# EAGLE design 100kw dc motor controller (EAGLE 7.4.0)
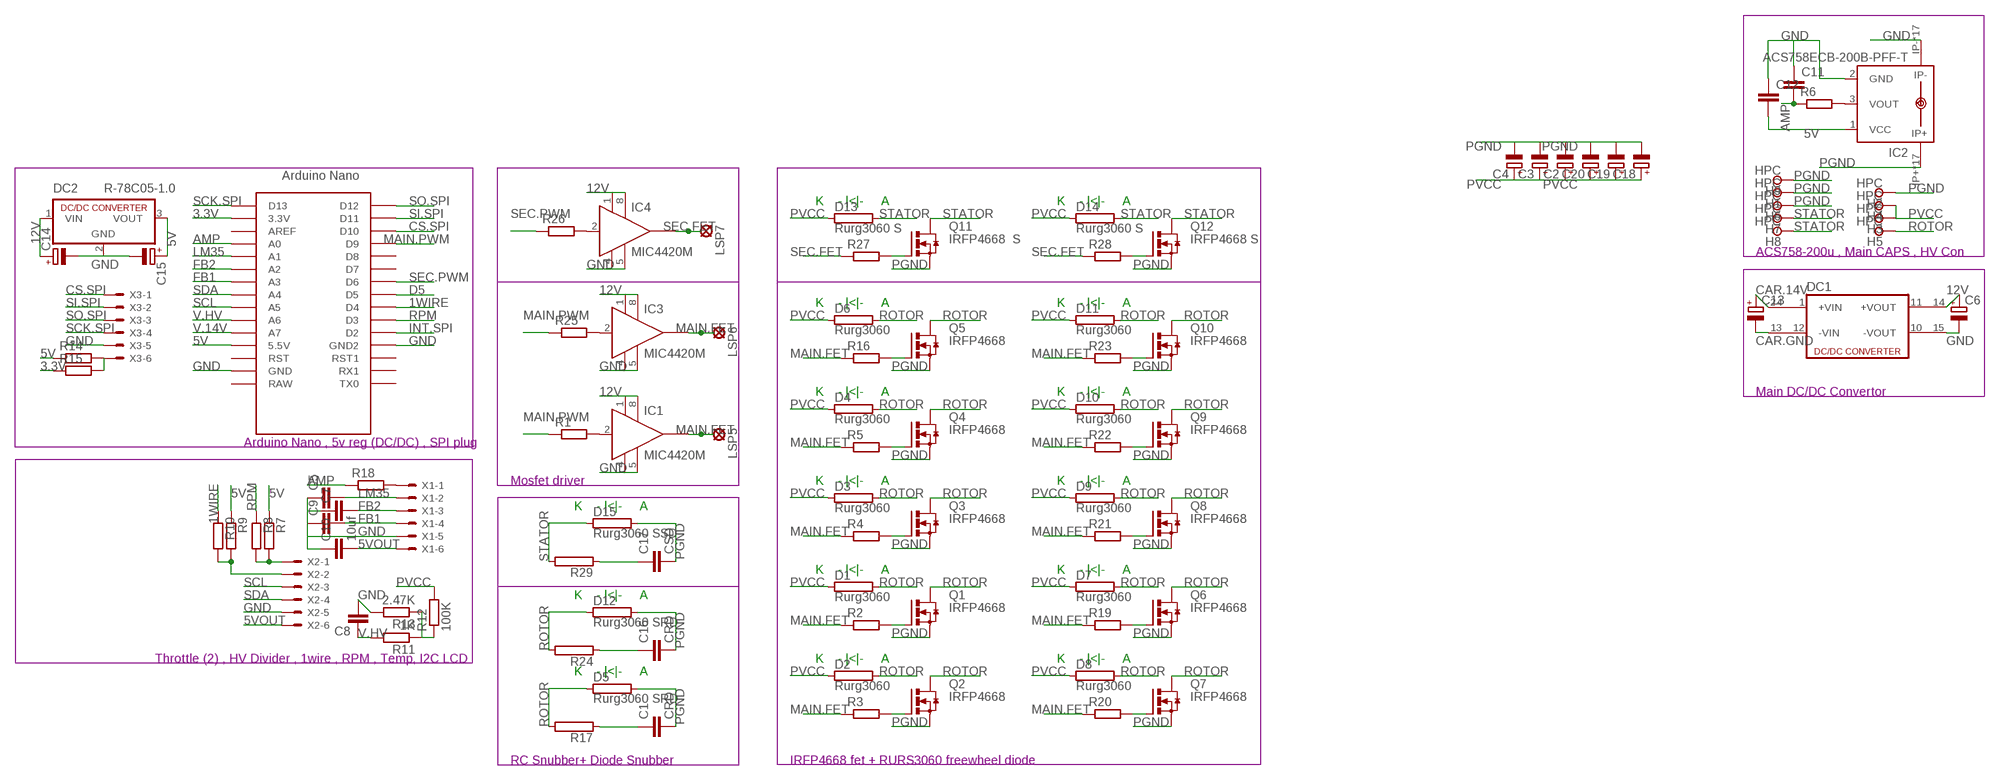
[diagram p0: schematic, sheet 1]

## Parts
C1  CRD  C37/20  [C37.5B20]
C2  CPOL-EUE10-35  [EB35D]
C3  CPOL-EUE10-35  [EB35D]
C4  CPOL-EUE10-35  [EB35D]
C5  C-EUC1206  [C1206]
C6  CPOL-EUE3.5-10  [E3,5-10]
C7  C-EUC1206  [C1206]
C8  C-EUC1206  [C1206]
C9  C-EUC1206  [C1206]
C10  10uf  C-EUC1812  [C1812]
C11  C-EUC1206  [C1206]
C12  C-EUC1206  [C1206]
C13  CPOL-EUE3.5-10  [E3,5-10]
C14  CPOL-EUD/7343-31W  [D/7343-31W]
C15  CPOL-EUD/7343-31W  [D/7343-31W]
C16  CRD  C37/20  [C37.5B20]
C17  CSD  C37/20  [C37.5B20]
C18  CPOL-EUE10-35  [EB35D]
C19  CPOL-EUE10-35  [EB35D]
C20  CPOL-EUE10-35  [EB35D]
D1  Rurg3060  RMG100-H  [TO-247-2H]
D2  Rurg3060  RMG100-H  [TO-247-2H]
D3  Rurg3060  RMG100-H  [TO-247-2H]
D4  Rurg3060  RMG100-H  [TO-247-2H]
D5  Rurg3060 SRD  RMG100-V  [TO-247-2V]
D6  Rurg3060  RMG100-H  [TO-247-2H]
D7  Rurg3060  RMG100-H  [TO-247-2H]
D8  Rurg3060  RMG100-H  [TO-247-2H]
D9  Rurg3060  RMG100-H  [TO-247-2H]
D10  Rurg3060  RMG100-H  [TO-247-2H]
D11  Rurg3060  RMG100-H  [TO-247-2H]
D12  Rurg3060 SRD  RMG100-V  [TO-247-2V]
D13  Rurg3060 S  RMG100-H  [TO-247-2H]
D14  Rurg3060 S  RMG100-H  [TO-247-2H]
D15  Rurg3060 SSD  RMG100-V  [TO-247-2V]
DC1  DCW1U  [DCW]
DC2  R-78C05-1.0  R-78C3.3-1.0  [SIP3]
H1  HPC  SPECIAL_DRILL_0.2500  [PAD_0.2500]
H2  HPC  SPECIAL_DRILL_0.2500  [PAD_0.2500]
H3  HPC  SPECIAL_DRILL_0.2500  [PAD_0.2500]
H4  HPC  SPECIAL_DRILL_0.2500  [PAD_0.2500]
H5  HPC  SPECIAL_DRILL_0.2500  [PAD_0.2500]
H6  HPC  SPECIAL_DRILL_0.2500  [PAD_0.2500]
H7  HPC  SPECIAL_DRILL_0.2500  [PAD_0.2500]
H8  HPC  SPECIAL_DRILL_0.2500  [PAD_0.2500]
H9  HPC  SPECIAL_DRILL_0.2500  [PAD_0.2500]
IC1  MIC4420M  [SO-08]
IC2  ACS758ECB-200B-PFF-T  [CB-PFF]
IC3  MIC4420M  [SO-08]
IC4  MIC4420M  [SO-08]
LSP5  LSP11  [LSP11]
LSP6  LSP11  [LSP11]
LSP7  LSP11  [LSP11]
Q1  IRFP4668  IRFP240-H  [TO247BH]
Q2  IRFP4668  IRFP240-H  [TO247BH]
Q3  IRFP4668  IRFP240-H  [TO247BH]
Q4  IRFP4668  IRFP240-H  [TO247BH]
Q5  IRFP4668  IRFP240-H  [TO247BH]
Q6  IRFP4668  IRFP240-H  [TO247BH]
Q7  IRFP4668  IRFP240-H  [TO247BH]
Q8  IRFP4668  IRFP240-H  [TO247BH]
Q9  IRFP4668  IRFP240-H  [TO247BH]
Q10  IRFP4668  IRFP240-H  [TO247BH]
Q11  IRFP4668 S  IRFP240-H  [TO247BH]
Q12  IRFP4668 S  IRFP240-H  [TO247BH]
R1  R-EU_R1206  [R1206]
R2  R-EU_M5923  [M5923]
R3  R-EU_M5923  [M5923]
R4  R-EU_M5923  [M5923]
R5  R-EU_M5923  [M5923]
R6  R-EU_R1206  [R1206]
R7  R-EU_R1206  [R1206]
R8  R-EU_R1206  [R1206]
R9  R-EU_R1206  [R1206]
R10  R-EU_R1206  [R1206]
R11  1K  R-EU_R1206  [R1206]
R12  100K  R-EU_R1206  [R1206]
R13  2.47K  R-EU_R1206  [R1206]
R14  R-EU_R1206  [R1206]
R15  R-EU_R1206  [R1206]
R16  R-EU_M5923  [M5923]
R17  RKH208-8R  [KH208R-8]
R18  R-EU_R1206  [R1206]
R19  R-EU_M5923  [M5923]
R20  R-EU_M5923  [M5923]
R21  R-EU_M5923  [M5923]
R22  R-EU_M5923  [M5923]
R23  R-EU_M5923  [M5923]
R24  RKH208-8R  [KH208R-8]
R25  R-EU_R1206  [R1206]
R26  R-EU_R1206  [R1206]
R27  R-EU_M5923  [M5923]
R28  R-EU_M5923  [M5923]
R29  RKH208-8R  [KH208R-8]
U$1  NANO  [NANO]
X1  22-23-2061  [22-23-2061]
X2  22-23-2061  [22-23-2061]
X3  22-23-2061  [22-23-2061]

## Nets
1WIRE: R10.1 U$1.D4
3.3V: R15.1 U$1.3.3V
5V: C12.2 C15.+ DC2.3(VOUT) IC2.1(VCC) R7.1 R9.1 R14.1 U$1.5V(5.5V)
5VOUT: C10.2 X1.6 X2.6
12V: C6.+ C14.+ DC1.14(+VOUT1) DC2.1(VIN) IC1.1(VS) IC1.8(VS1) IC3.1(VS) IC3.8(VS1) IC4.1(VS) IC4.8(VS1)
AMP: C11.2 R6.1 R18.1 U$1.A0
CAR.14V: C13.+ DC1.24(+VIN1)
CAR.GND: C13.- DC1.13(-VIN1)
CS.SPI: U$1.D10 X3.1
D5: U$1.D5
FB1: C9.2 U$1.A3 X1.4
FB2: C7.2 U$1.A2 X1.3
GND: C5.1 C6.- C7.1 C8.2 C9.1 C10.1 C11.1 C12.1 C14.- C15.- DC1.15(-VOUT1) DC2.2(GND) IC1.4(GND) IC1.5(GND1) IC2.2(GND) IC2.IP- IC2.IP-@2(IP-) IC2.IP-@3(IP-) IC2.IP-@4(IP-) IC2.IP-@5(IP-) IC2.IP-@6(IP-) IC2.IP-@7(IP-) IC2.IP-@8(IP-) IC2.IP-@9(IP-) IC2.IP-@10(IP-) IC2.IP-@11(IP-) IC2.IP-@12(IP-) IC2.IP-@13(IP-) IC2.IP-@14(IP-) IC2.IP-@15(IP-) IC2.IP-@16(IP-) IC2.IP-@17(IP-) IC3.4(GND) IC3.5(GND1) IC4.4(GND) IC4.5(GND1) R13.2 U$1.GND U$1.GND1(GND2) X1.5 X2.5 X3.5
INT.SPI: U$1.D2
LM35: C5.2 U$1.A1 X1.2
MAIN.FET: IC1.6(OUT) IC3.6(OUT) LSP5.MP LSP6.MP R2.1 R3.1 R4.1 R5.1 R16.1 R19.1 R20.1 R21.1 R22.1 R23.1
MAIN.PWM: R1.1 R25.1 U$1.D9
N$1: IC1.2(IN) R1.2
N$2: Q1.G R2.2
N$3: Q2.G R3.2
N$4: Q3.G R4.2
N$5: Q4.G R5.2
N$6: IC2.3(VOUT) R6.2
N$7: R9.2 R10.2 X2.2
N$8: R7.2 R8.2 X2.1
N$9: R14.2 R15.2 X3.6
N$10: Q5.G R16.2
N$11: C1.1 R17.1
N$12: R18.2 X1.1
N$13: R11.1 R12.1 R13.1
N$14: Q6.G R19.2
N$15: Q7.G R20.2
N$16: Q8.G R21.2
N$17: Q9.G R22.2
N$18: Q10.G R23.2
N$19: C16.1 R24.1
N$20: IC3.2(IN) R25.2
N$21: IC4.2(IN) R26.2
N$22: Q11.G R27.2
N$23: Q12.G R28.2
N$24: C17.1 R29.1
PGND: C1.2 C2.- C3.- C4.- C16.2 C17.2 C18.- C19.- C20.- D5.2 D12.2 D15.2 H1.1 H2.1 H6.1 H9.1 IC2.IP+ IC2.IP+@2(IP+) IC2.IP+@3(IP+) IC2.IP+@4(IP+) IC2.IP+@5(IP+) IC2.IP+@6(IP+) IC2.IP+@7(IP+) IC2.IP+@8(IP+) IC2.IP+@9(IP+) IC2.IP+@10(IP+) IC2.IP+@11(IP+) IC2.IP+@12(IP+) IC2.IP+@13(IP+) IC2.IP+@14(IP+) IC2.IP+@15(IP+) IC2.IP+@16(IP+) IC2.IP+@17(IP+) Q1.S Q2.S Q3.S Q4.S Q5.S Q6.S Q7.S Q8.S Q9.S Q10.S Q11.S Q12.S
PVCC: C2.+ C3.+ C4.+ C18.+ C19.+ C20.+ D1.1 D2.1 D3.1 D4.1 D6.1 D7.1 D8.1 D9.1 D10.1 D11.1 D13.1 D14.1 H3.1 H4.1 R12.2
ROTOR: D1.2 D2.2 D3.2 D4.2 D5.1 D6.2 D7.2 D8.2 D9.2 D10.2 D11.2 D12.1 H5.1 Q1.D Q2.D Q3.D Q4.D Q5.D Q6.D Q7.D Q8.D Q9.D Q10.D R17.2 R24.2
RPM: R8.1 U$1.D3
SCK.SPI: U$1.D13 X3.4
SCL: U$1.A5 X2.3
SDA: U$1.A4 X2.4
SEC.FET: IC4.6(OUT) LSP7.MP R27.1 R28.1
SEC.PWM: R26.1 U$1.D6
SI.SPI: U$1.D11 X3.2
SO.SPI: U$1.D12 X3.3
STATOR: D13.2 D14.2 D15.1 H7.1 H8.1 Q11.D Q12.D R29.2
V.14V: U$1.A7
V.HV: C8.1 R11.2 U$1.A6
Unconnected: DC1.1(+VIN) DC1.10(-VOUT) DC1.11(+VOUT) DC1.12(-VIN) IC1.7(OUT) IC3.7(OUT) IC4.7(OUT) U$1.AREF U$1.D7 U$1.D8 U$1.ICSP1 U$1.ICSP2 U$1.ICSP3 U$1.ICSP4 U$1.ICSP5 U$1.ICSP6 U$1.RAW U$1.RST U$1.RST1 U$1.RX1 U$1.TX0

## Notes on the sheet
- K    - |<|-     A | K    - |<|-     A
- ACS758-200u , Main CAPS , HV Con
- K    - |<|-     A | K    - |<|-     A
- K    - |<|-     A | K    - |<|-     A | Main DC/DC Convertor
- Arduino Nano , 5v reg (DC/DC) , SPI plug
- Mosfet driver | K    - |<|-     A | K    - |<|-     A
- K    - |<|-     A
- K    - |<|-     A | K    - |<|-     A
- K    - |<|-     A
- Throttle (2) , HV Divider , 1wire , RPM , Temp, I2C LCD | K    - |<|-     A | K    - |<|-     A
- K    - |<|-     A
- RC Snubber+ Diode Snubber | IRFP4668 fet + RURS3060 freewheel diode

## Library data of the parts
C1 C16 C17 = capacitor-wima:C: CAPACITOR naming: grid - package width
C2-C4 C6 C13-C15 C18-C20 = rcl:CPOL-EU: POLARIZED CAPACITOR, European symbol
C5 C7-C12 = rcl:C-EU: CAPACITOR, European symbol
D1-D15 = resistor-power:RMG100: TO-247 Power Resistor - RMG 100 Series Source: www.token.com.tw .. power-resistor-rmg100pdf; OC_FARNELL: unknown; OC_NEWARK: unknown
DC1 = dc-dc-converter:DCW1U: DC-DC CONVERTER; OC_FARNELL: unknown; OC_NEWARK: unknown
DC2 = dc-dc-converter:R-78C*-1.0: INNOLINE DC/DC-Converter 1.0 AMP SIP3 Single Output Source: Data sheet <http://www.mikrocontroller.net/attachment/150645/157764-da-01-en-DC_DC_WANDLER_R_78C5_0_1_0.pdf>
H1-H9 = special-drill:SPECIAL_DRILL_: Special drills
IC1 IC3 IC4 = transistor-power:MIC4420: 6A-Peak Low-Side MOSFET Driver Bipolar/CMOS/DMOS Process http://www.micrel.com/_PDF/mic4420.pdf
IC2 = allegro:ACS758*: Thermally Enhanced, Fully Integrated, Hall Effect-Based Linear Current Sensor with 100 micro Ohm Current Conductor display layer 49 Reference in BRD and place VIAs on circles Source: http://www.allegromicro.com/en/Products/Part_Numbers/0758/0758.pdf; MPN: ACS758ECB-200B-PFF-T; OC_FARNELL: 1718993; OC_NEWARK: 04R7127
LSP5-LSP7 = solpad:LSP11: SOLDER PAD drill 1.1 mm
Q1-Q12 = transistor-power:IRFP240: HEXFET Power MosFet Source: http://www.irf.com/
R1-R16 R18-R23 R25-R28 = rcl:R-EU_: RESISTOR, European symbol
R17 R24 R29 = resistor-power:R: Power Resitor; OC_FARNELL: unknown; OC_NEWARK: unknown
U$1 = Arduino-clone (1):NANO: Arduino Nano
X1-X3 = con-molex:22-23-2061: .100" (2.54mm) Center Header - 6 Pin; MF: MOLEX; MPN: 22-23-2061; OC_FARNELL: 1462922; OC_NEWARK: 27C1933

## Board
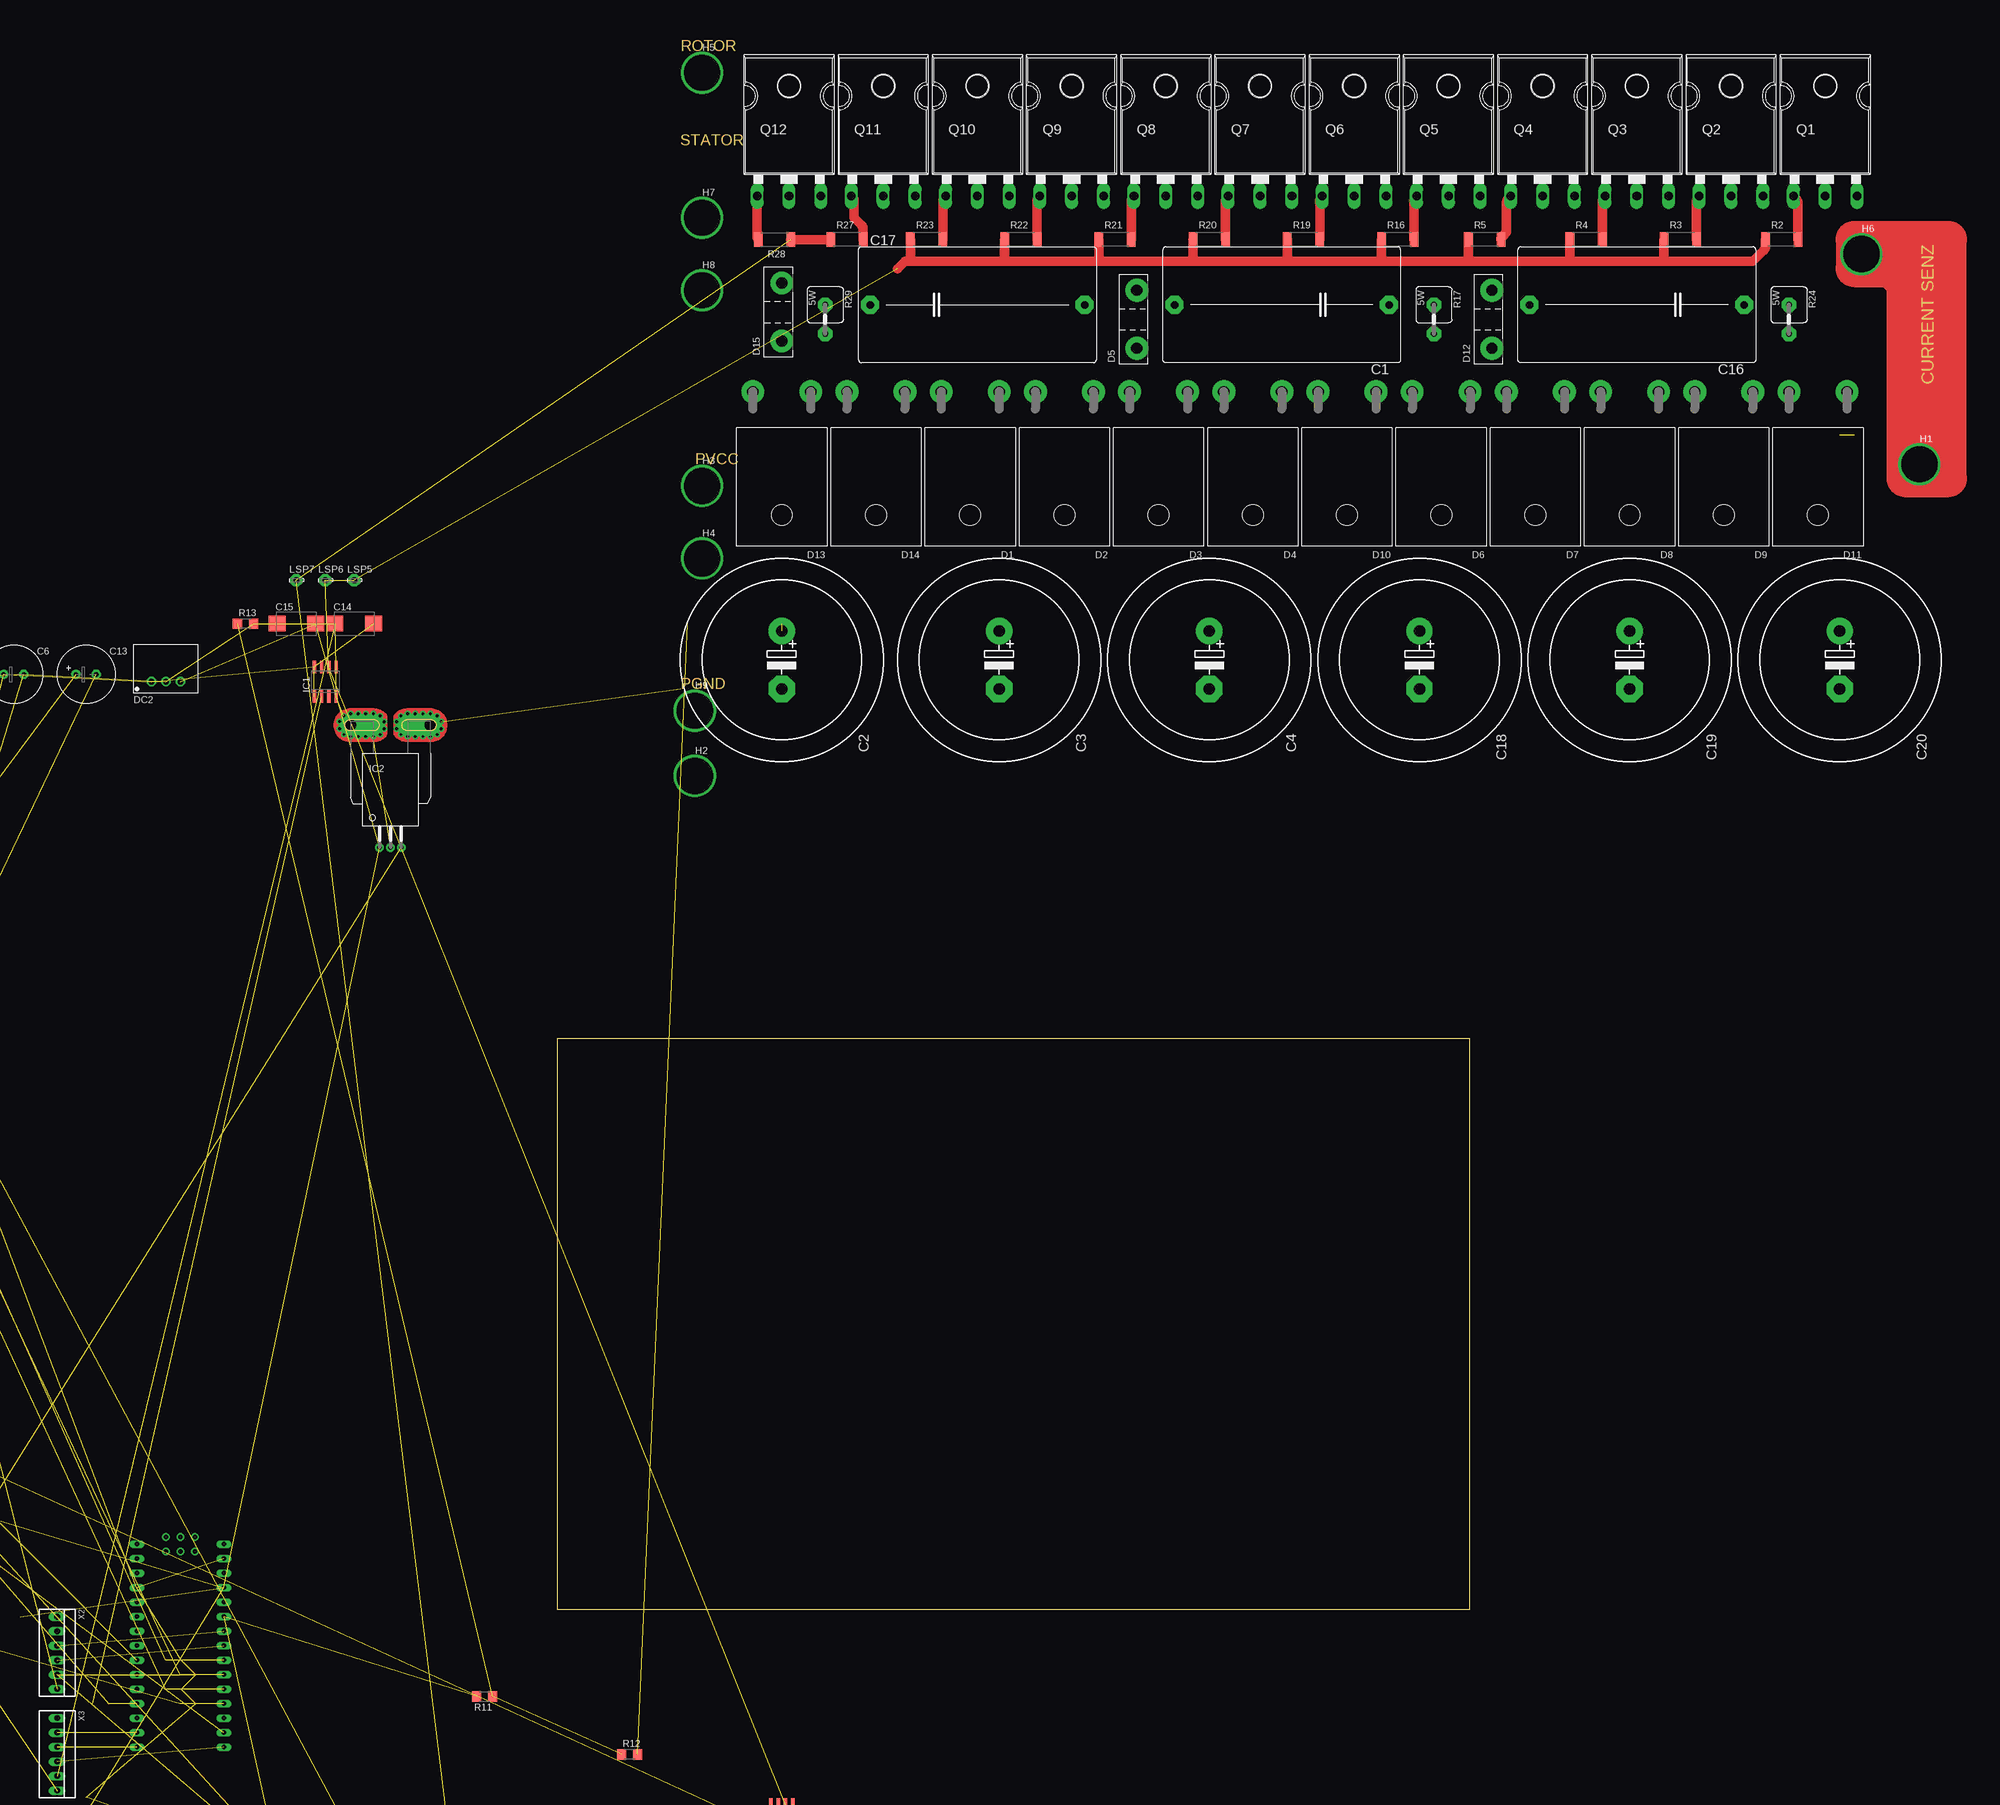
[diagram p1: board, top side]
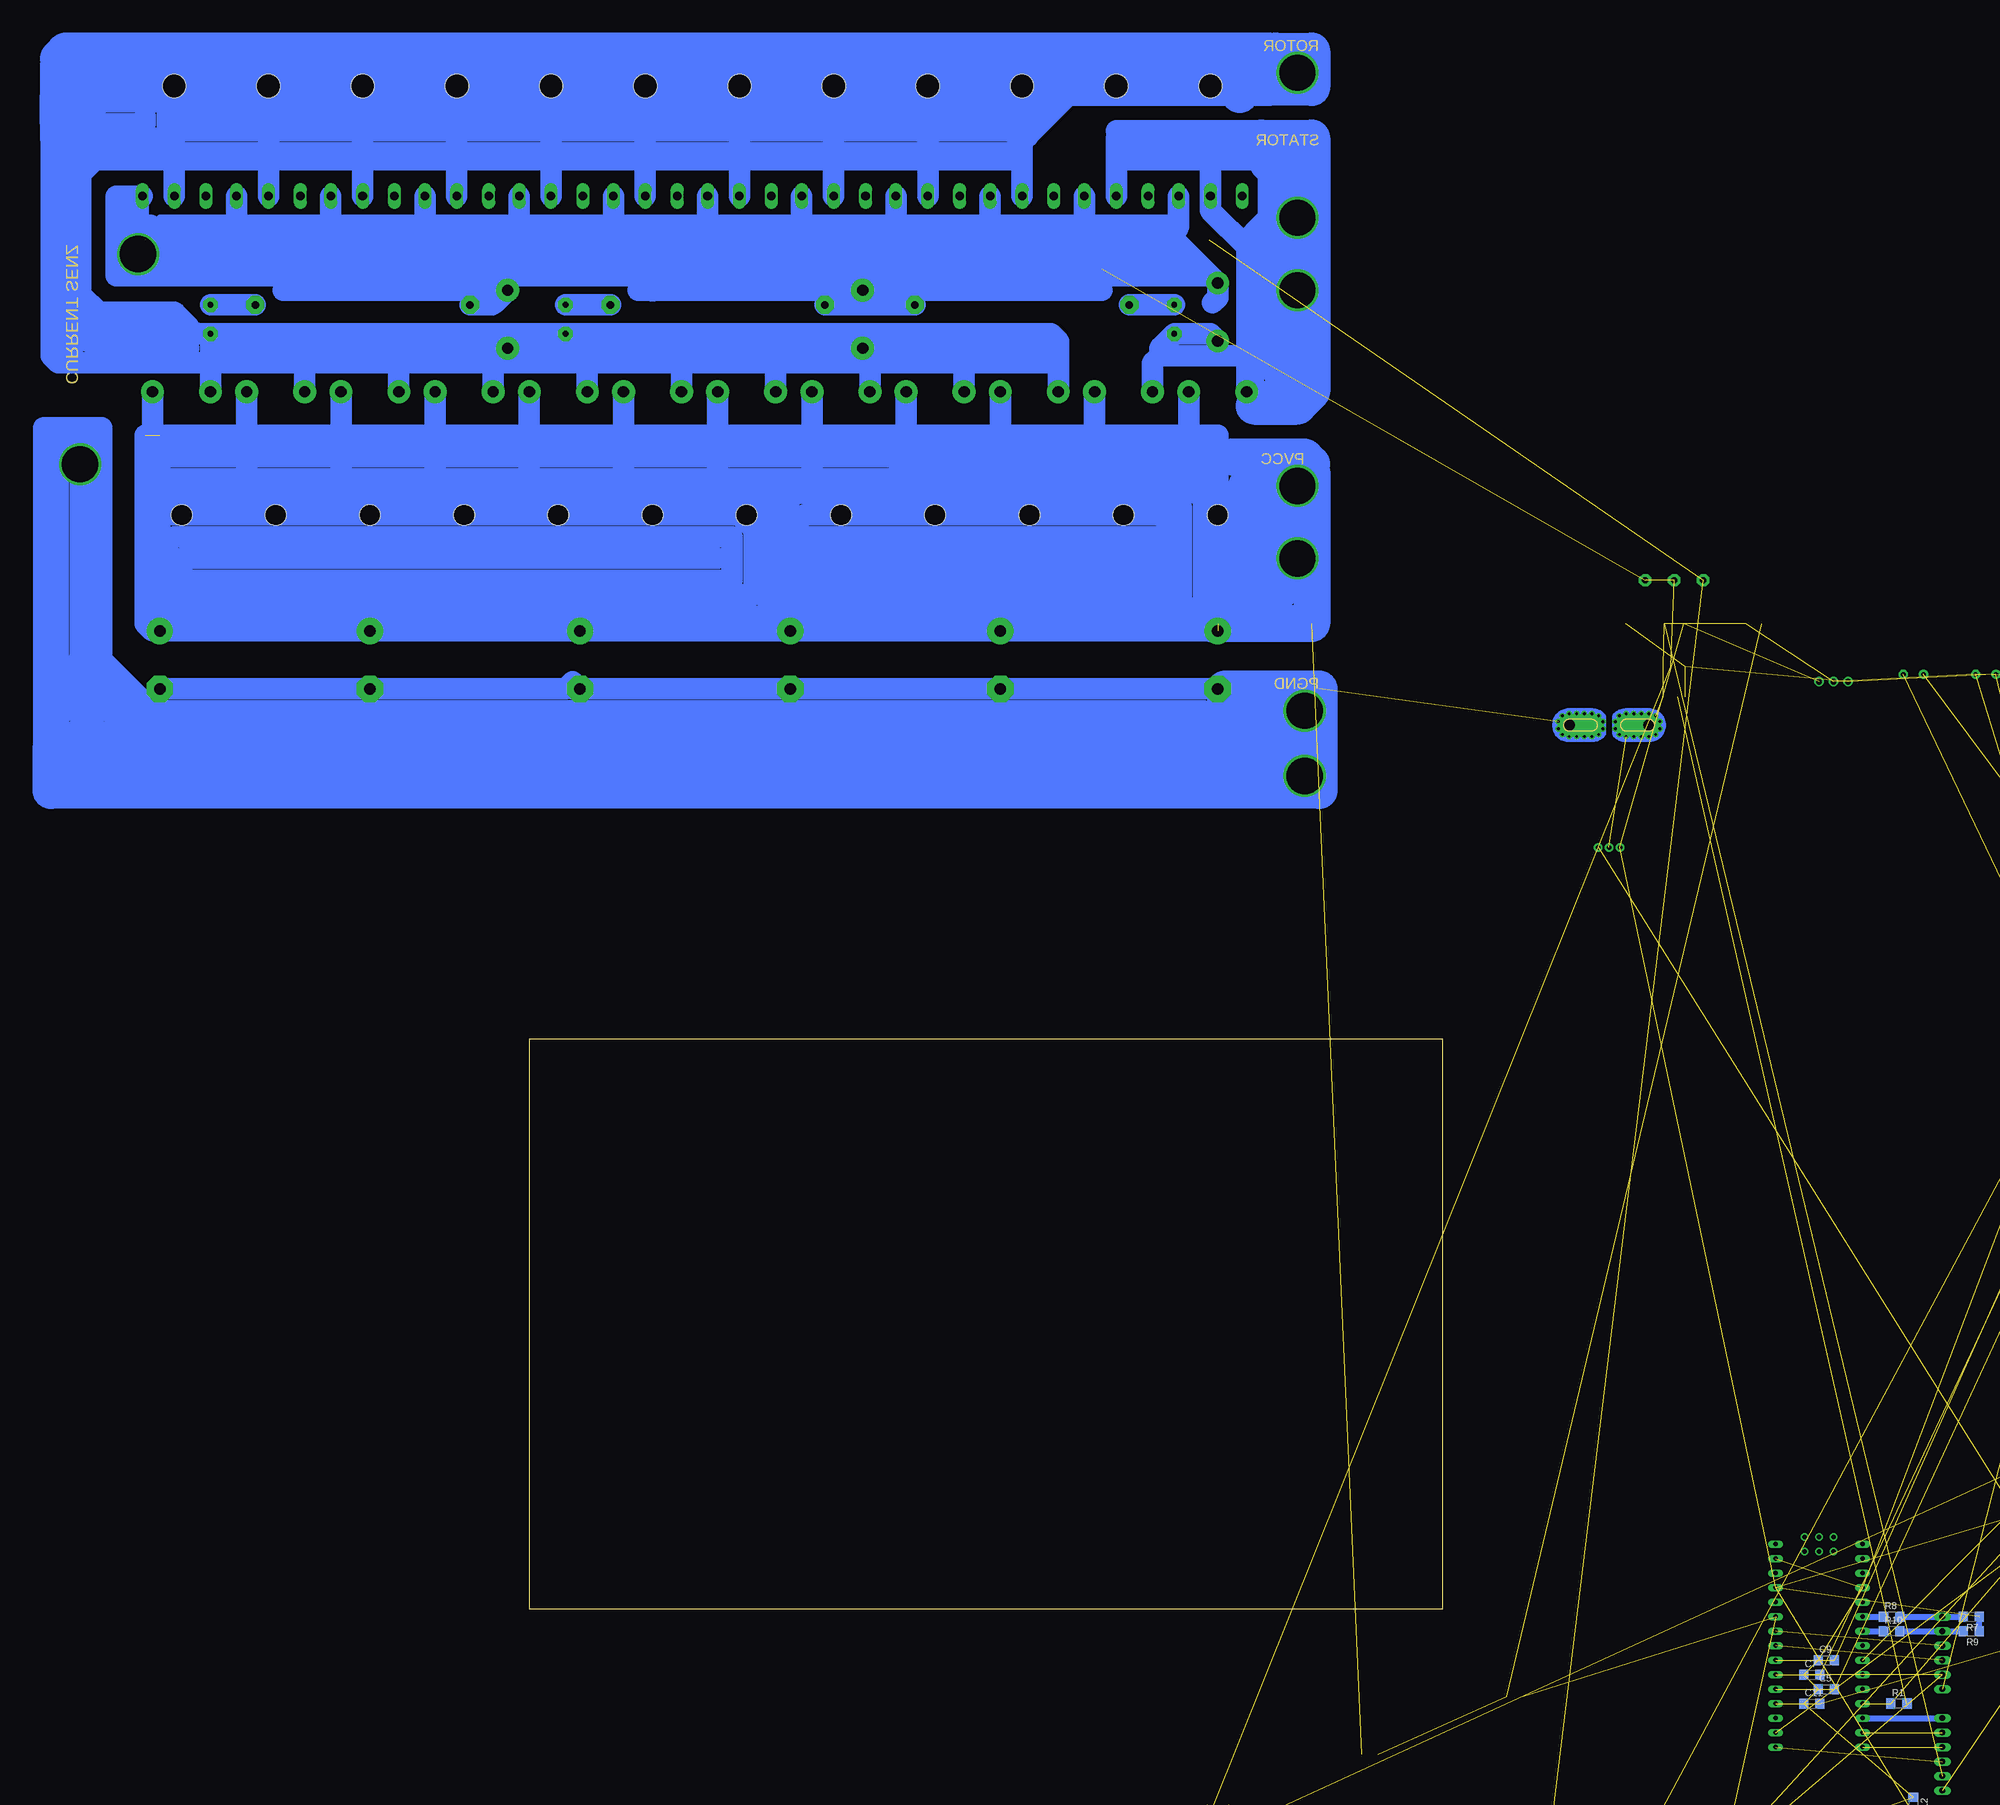
[diagram p2: board, bottom side, seen from below]

Size 160 x 100 mm. Coordinates in mm from the lower left corner, seen from the top.
Outline: 0,0 160,0 160,100 0,100 0,0
Copper layers (1*16): Top 0.035mm / dielectric 1.5mm / Bottom 0.035mm
Design rules "default": minimum track width 10mil, minimum drill 24mil, track to track 8mil, track to pad 8mil, pad to pad 8mil, via to via 8mil, smd to smd 8mil, copper to edge 40mil, drill to drill 8mil, minimum pad ring 10mil, minimum via ring 8mil, stop-mask expansion 4mil, vias tented up to drill 0mil, thermal gap 10mil

### Footprints (pad centres in the part's own frame; a part is rotated, then mirrored left to right if it is on the bottom)
C37.5B20 = drill 1.321 pad 3.15 octagon: 1 -18.796,0; 2 18.796,0
EB35D = drill 2.007 pad 4.597: + -5.08,0 | drill 2.007 pad 4.597 octagon: - 5.08,0
C1206 = smd 1.6 x 1.8: 1 -1.4,0; 2 1.4,0
E3,5-10 = drill 0.813 pad 1.6: + -1.778,0 | drill 0.813 pad 1.6 octagon: - 1.778,0
C1812 = smd 1.9 x 3.4: 1 -1.95,0; 2 1.95,0
D/7343-31W = smd 2.95 x 2.7: + 3.375,0; - -3.375,0
TO-247-2H = drill 2 pad 4: 1 -5.08,-21.59; 2 5.08,-21.59 | hole 3.7: 0,0
TO-247-2V = drill 2 pad 4: 1 -5.08,0; 2 5.08,0
DCW = drill 0.813 long: 1 -7.62,13.97; 2 -7.62,11.43; 3 -7.62,8.89; 10 -7.62,-8.89; 11 -7.62,-11.43; 12 -7.62,-13.97; 13 7.62,-13.97; 14 7.62,-11.43; 15 7.62,-8.89; 22 7.62,8.89; 23 7.62,11.43; 24 7.62,13.97
SIP3 = drill 1 pad 1.676: 1 -2.54,0; 2 0,0; 3 2.54,0
PAD_0.2500 = drill 6.35 pad 6.35: 1 0,0
SO-08 = smd 0.6 x 2.2: 1 -1.905,-2.6; 2 -0.635,-2.6; 3 0.635,-2.6; 4 1.905,-2.6; 5 1.905,2.6; 6 0.635,2.6; 7 -0.635,2.6; 8 -1.905,2.6
CB-PFF = drill 0.8 pad 1.5: 1 -1.91,-21.4; 2 0,-21.4; 3 1.91,-21.4 | drill 2 pad 4 offset: IP+ 7,0; IP- -7,0 | drill 0.5 pad 0.9: IP+@2 8.89,0.635; IP+@3 8.89,-0.635; IP+@4 8.175,-1.625; IP+@5 7,-2; IP+@6 5.675,-2; IP+@7 4.35,-2; IP+@8 3,-2; IP+@9 1.825,-1.625; IP+@10 1.1,-0.625; IP+@11 1.1,0.625; IP+@12 1.825,1.625; IP+@13 3,2; IP+@14 4.35,2; IP+@15 5.675,2; IP+@16 7,2; IP+@17 8.175,1.625; IP-@2 -8.89,0.635; IP-@3 -8.89,-0.635; IP-@4 -8.175,-1.625; IP-@5 -7,-2; IP-@6 -5.675,-2; IP-@7 -4.325,-2; IP-@8 -3,-2; IP-@9 -1.825,-1.625; IP-@10 -1.1,-0.625; IP-@11 -1.1,0.625; IP-@12 -1.825,1.625; IP-@13 -3,2; IP-@14 -4.325,2; IP-@15 -5.675,2; IP-@16 -7,2; IP-@17 -8.175,1.625
LSP11 = drill 1.118 pad 2.159 octagon: MP 0,0
TO247BH = drill 1.499 long: D 0,-10.16; G -5.588,-10.16; S 5.588,-10.16 | hole 4.115: 0,9.144
R1206 = smd 1.6 x 1.803: 1 -1.422,0; 2 1.422,0
M5923 = smd 1.5 x 2.6: 1 -2.85,0; 2 2.85,0
KH208R-8 = drill 1.016 pad 2.54 octagon: 1 -2.54,0; 2 2.54,0
NANO = drill 0.8 long: 3.3V -10.16,24.13; 5V -10.16,-1.27; A0 -10.16,19.05; A1 -10.16,16.51; A2 -10.16,13.97; A3 -10.16,11.43; A4 -10.16,8.89; A5 -10.16,6.35; A6 -10.16,3.81; A7 -10.16,1.27; AREF -10.16,21.59; D2 5.08,1.27; D3 5.08,3.81; D4 5.08,6.35; D5 5.08,8.89; D6 5.08,11.43; D7 5.08,13.97; D8 5.08,16.51; D9 5.08,19.05; D10 5.08,21.59; D11 5.08,24.13; D12 5.08,26.67; D13 -10.16,26.67; GND -10.16,-6.35; GND1 5.08,-1.27; RAW -10.16,-8.89; RST -10.16,-3.81; RST1 5.08,-3.81; RX1 5.08,-6.35; TX0 5.08,-8.89 | drill 0.8: ICSP1 -5.08,-10.16; ICSP2 -5.08,-7.62; ICSP3 -2.54,-10.16; ICSP4 -2.54,-7.62; ICSP5 0,-10.16; ICSP6 0,-7.62
22-23-2061 = drill 1 long: 1 -6.35,0; 2 -3.81,0; 3 -1.27,0; 4 1.27,0; 5 3.81,0; 6 6.35,0

### Placement (x,y rotation side)
C1  127,228.6 180 top  (outside the outline)
C2  39.37,166.37 270 top  (outside the outline)
C3  77.47,166.37 270 top  (outside the outline)
C4  114.3,166.37 270 top  (outside the outline)
C5  -67.31,-13.97 0 bottom  (outside the outline)
C6  -95.25,163.83 0 top  (outside the outline)
C7  -64.77,-11.43 0 bottom  (outside the outline)
C8  -49.53,-43.18 270 top  (outside the outline)
C9  -67.31,-8.89 0 bottom  (outside the outline)
C10  -134.62,162.56 0 top  (outside the outline)
C11  -64.77,-16.51 0 bottom  (outside the outline)
C12  -82.55,-34.29 270 bottom  (outside the outline)
C13  -82.55,163.83 0 top  (outside the outline)
C14  -35.56,172.72 0 top  (outside the outline)
C15  -45.72,172.72 0 top  (outside the outline)
C16  189.23,228.6 180 top  (outside the outline)
C17  73.66,228.6 0 top  (outside the outline)
C18  151.13,166.37 270 top  (outside the outline)
C19  187.96,166.37 270 top  (outside the outline)
C20  224.79,166.37 270 top  (outside the outline)
D1  72.39,191.77 180 top  (outside the outline)
D2  88.9,191.77 180 top  (outside the outline)
D3  105.41,191.77 180 top  (outside the outline)
D4  121.92,191.77 180 top  (outside the outline)
D5  101.6,226.06 90 top  (outside the outline)
D6  154.94,191.77 180 top  (outside the outline)
D7  171.45,191.77 180 top  (outside the outline)
D8  187.96,191.77 180 top  (outside the outline)
D9  204.47,191.77 180 top  (outside the outline)
D10  138.43,191.77 180 top  (outside the outline)
D11  220.98,191.77 180 top  (outside the outline)
D12  163.83,226.06 90 top  (outside the outline)
D13  39.37,191.77 180 top  (outside the outline)
D14  55.88,191.77 180 top  (outside the outline)
D15  39.37,227.33 90 top  (outside the outline)
DC1  -119.38,113.03 0 top  (outside the outline)
DC2  -68.58,162.56 0 top  (outside the outline)
H1  238.76,200.66 0 top  (outside the outline)
H2  24.13,146.05 0 top  (outside the outline)
H3  25.4,196.85 0 top  (outside the outline)
H4  25.4,184.15 0 top  (outside the outline)
H5  25.4,269.24 0 top  (outside the outline)
H6  228.6,237.49 0 top  (outside the outline)
H7  25.4,243.84 0 top  (outside the outline)
H8  25.4,231.14 0 top  (outside the outline)
H9  24.13,157.48 0 top  (outside the outline)
IC1  -40.64,162.56 0 top  (outside the outline)
IC2  -29.21,154.94 0 top  (outside the outline)
IC3  39.37,-36.83 0 top  (outside the outline)
IC4  -15.24,-77.47 0 top  (outside the outline)
LSP5  -35.56,180.34 0 top  (outside the outline)
LSP6  -40.64,180.34 0 top  (outside the outline)
LSP7  -45.72,180.34 0 top  (outside the outline)
Q1  222.25,257.81 0 top  (outside the outline)
Q2  205.74,257.81 0 top  (outside the outline)
Q3  189.23,257.81 0 top  (outside the outline)
Q4  172.72,257.81 0 top  (outside the outline)
Q5  156.21,257.81 0 top  (outside the outline)
Q6  139.7,257.81 0 top  (outside the outline)
Q7  123.19,257.81 0 top  (outside the outline)
Q8  106.68,257.81 0 top  (outside the outline)
Q9  90.17,257.81 0 top  (outside the outline)
Q10  73.66,257.81 0 top  (outside the outline)
Q11  57.15,257.81 0 top  (outside the outline)
Q12  40.64,257.81 0 top  (outside the outline)
R1  -80.01,-16.51 0 bottom  (outside the outline)
R2  214.63,240.03 0 top  (outside the outline)
R3  196.85,240.03 0 top  (outside the outline)
R4  180.34,240.03 0 top  (outside the outline)
R5  162.56,240.03 0 top  (outside the outline)
R6  -114.3,-3.81 270 bottom  (outside the outline)
R7  -92.71,-1.27 180 bottom  (outside the outline)
R8  -78.74,-1.27 0 bottom  (outside the outline)
R9  -92.71,-3.81 180 bottom  (outside the outline)
R10  -78.74,-3.81 0 bottom  (outside the outline)
R11  -12.7,-15.24 180 top  (outside the outline)
R12  12.7,-25.4 0 top  (outside the outline)
R13  -54.61,172.72 0 top  (outside the outline)
R14  -127,22.86 270 top  (outside the outline)
R15  -127,27.94 270 top  (outside the outline)
R16  147.32,240.03 0 top  (outside the outline)
R17  153.67,226.06 270 top  (outside the outline)
R18  -127,33.02 270 top  (outside the outline)
R19  130.81,240.03 0 top  (outside the outline)
R20  114.3,240.03 0 top  (outside the outline)
R21  97.79,240.03 0 top  (outside the outline)
R22  81.28,240.03 0 top  (outside the outline)
R23  64.77,240.03 0 top  (outside the outline)
R24  215.9,226.06 270 top  (outside the outline)
R25  -127,38.1 270 top  (outside the outline)
R26  -127,43.18 270 top  (outside the outline)
R27  50.8,240.03 0 top  (outside the outline)
R28  38.1,240.03 180 top  (outside the outline)
R29  46.99,226.06 270 top  (outside the outline)
U$1  -68.58,2.54 180 top  (outside the outline)
X1  -146.05,161.29 0 top  (outside the outline)
X2  -87.63,-7.62 270 top  (outside the outline)
X3  -87.63,-25.4 270 top  (outside the outline)

### Tracks (layer width: path | path; a pad name or v marks a point on that pad's centre or on a via)
1WIRE
  Bottom 1.016: U$1.D4 R10.1
3.3V  (1 unrouted)
5V  (6 unrouted)
  Bottom 1.016: R9.1 R7.1
5VOUT  (2 unrouted)
12V  (9 unrouted)
AMP  (3 unrouted)
CAR.14V  (1 unrouted)
CAR.GND  (1 unrouted)
CS.SPI
  Bottom 1.016: U$1.D10 X3.1
FB1  (2 unrouted)
FB2  (2 unrouted)
GND  (25 unrouted)
LM35  (2 unrouted)
MAIN.FET  (4 unrouted)
  Top 1.676: R2.1 211.78,238.98 arc-45 211.41,238.08 209.55,236.22 194.31,236.22 | 194.31,236.22 177.8,236.22 | 177.8,236.22 160.02,236.22 | 160.02,236.22 144.78,236.22 | 144.78,236.22 128.27,236.22 | 128.27,236.22 111.76,236.22 | 111.76,236.22 95.25,236.22 | 95.25,236.22 78.74,236.22 | 78.74,236.22 62.23,236.22 | 62.23,236.22 60.96,236.22 59.69,234.95 | R23.1 61.92,236.97 arc45 62.23,236.22 | R22.1 78.43,236.97 arc45 78.74,236.22 | R21.1 94.94,236.97 arc45 95.25,236.22 | R20.1 111.45,236.97 arc45 111.76,236.22 | R19.1 127.96,236.97 arc45 128.27,236.22 | R16.1 144.47,236.97 arc45 144.78,236.22 | R5.1 159.71,236.97 arc45 160.02,236.22 | R4.1 177.49,236.97 arc45 177.8,236.22 | R3.1 194,236.97 arc45 194.31,236.22
MAIN.PWM  (2 unrouted)
N$1  (1 unrouted)
N$2
  Top 1.676: R2.2 217.48,246.31 arc45 217.11,247.2 Q1.G
N$3
  Top 1.676: R3.2 199.7,246.67 arc-45 200.07,247.57 Q2.G
N$4
  Top 1.676: R4.2 183.19,246.67 arc-45 183.56,247.57 Q3.G
N$5
  Top 1.676: R5.2 arc-45 165.63,240.56 166.37,241.3 166.37,246.36 arc-45 166.74,247.26 Q4.G
N$6  (1 unrouted)
N$7
  Bottom 1.016: R10.2 X2.2 R9.2
N$8
  Bottom 1.016: R8.2 X2.1 R7.2
N$9  (2 unrouted)
N$10
  Top 1.676: R16.2 150.17,246.67 arc-45 150.54,247.57 Q5.G
N$11
  Bottom 3.81: R17.1 C1.1
N$12  (1 unrouted)
N$13  (2 unrouted)
N$14
  Top 1.676: R19.2 133.66,246.67 arc-45 134.03,247.57 Q6.G
N$15
  Top 1.676: R20.2 117.15,246.67 arc-45 117.52,247.57 Q7.G
N$16
  Top 1.676: R21.2 100.64,246.67 arc-45 101.01,247.57 Q8.G
N$17
  Top 1.676: R22.2 84.13,246.67 arc-45 84.5,247.57 Q9.G
N$18
  Top 1.676: R23.2 67.62,246.67 arc-45 67.99,247.57 Q10.G
N$19
  Bottom 3.81: R24.1 C16.1
N$20  (1 unrouted)
N$21  (1 unrouted)
N$22
  Top 1.676: R27.2 53.65,241.73 arc45 53.28,242.63 52.07,243.84 52.07,246.62 arc45 51.7,247.51 Q11.G
N$23
  Top 1.676: Q12.G 35.05,240.51 arc45 R28.2
N$24
  Bottom 3.81: C17.1 R29.1
N$25
  Top 6.452: 242.57,236.22 238.76,236.22
N$26
  Bottom 6.452: 242.57,260.35 242.57,265.17 arc45 242.38,265.62 241.3,266.7 237.49,262.89 237.49,263.9 arc-45 237.68,264.35 240.03,266.7 30.48,266.7 30.48,273.05 241.04,273.05 arc-45 241.49,272.86 242.57,271.78
N$27
  Bottom 6.452: 242.57,270.51 242.57,257.81
N$28
  Bottom 6.452: 36.83,201.93 24.39,201.93 arc45 23.94,201.74 22.86,200.66
N$29
  Bottom 3.81: 225.05,222.25 224.79,219.71 | 224.79,219.71 223.52,222.25 223.52,223.26 arc-45 223.71,223.71 224.79,219.71 | 224.79,219.71 234.69,222.25 | 237.49,222.25 234.69,222.25 | 234.69,222.25 225.05,222.25 | 225.05,222.25 arc45 224.6,222.06 219.71,220.98
N$30
  Bottom 3.81: 231.14,242.57 231.14,236.22
N$31
  Bottom 1.27: 224.79,243.84 45.72,243.84
N$34
  Bottom 6.452: 29.21,273.05 22.86,273.05 22.86,266.7 34.03,266.7 arc-45 34.48,266.51 35.56,265.43
PGND  (2 unrouted)
  Top 6.452: H6.1 234.69,237.49 arc-45 235.14,237.3 240.03,232.41 240.03,202.19 | 240.03,202.19 arc-45 239.84,201.74 | 240.03,202.19 arc-45 239.84,201.74 | 239.84,201.74 H1.1 | 243.84,198.12 243.84,240.03 227.33,240.03 227.33,234.95 233.68,234.95 236.22,232.41 236.22,198.12 243.84,198.12
  Bottom 1.422: 138.43,231.14 137.42,231.14 arc-45 136.97,231.33 133.35,234.95 135.63,234.95 arc-45 136.08,234.76 138.43,232.41
  Bottom 3.81: Q10.S 79.25,240.79 | 79.25,240.79 80.01,240.03 95.25,240.03 | 95.25,240.03 102.87,240.03 | 102.87,240.03 111.76,240.03 | 111.76,240.03 128.27,240.03 | 128.27,240.03 144.78,240.03 | 144.78,240.03 162.56,240.03 | 162.56,240.03 165.1,240.03 | 165.1,240.03 177.8,240.03 | 177.8,240.03 194.31,240.03 | 194.31,240.03 210.82,240.03 | 210.82,240.03 227.33,240.03 228.6,241.3 | 228.6,241.3 228.6,242.57 | 228.6,242.57 228.6,246.89 Q1.S | Q9.S 95.76,240.54 95.25,240.03 | Q8.S 112.27,240.54 111.76,240.03 | Q7.S 128.78,240.54 128.27,240.03 | Q6.S 145.29,240.54 144.78,240.03 | Q5.S 161.8,240.79 162.56,240.03 | Q4.S 178.31,240.54 177.8,240.03 | Q3.S 194.82,240.54 194.31,240.03 | Q2.S 211.33,240.54 210.82,240.03 | C1.2 103.4,228.6 | 103.4,228.6 arc-45 102.5,228.97 101.6,229.87 D5.2 101.6,233.68 | 40.27,228.97 39.37,229.87 D15.2 45.72,238.76 | 101.6,234.69 101.6,238.76 102.87,240.03 | 165.1,240.03 163.83,238.76 D12.2 166,228.97 arc45 166.9,228.6 C16.2 arc-45 170,228.78 167.64,231.14 203.2,231.14 | Q11.S 62.74,242.59 arc45 63.11,241.69 63.5,240.03 | 76.94,240.03 arc-45 77.84,239.66 | 77.84,239.66 78.74,240.03 | Q12.S 46.23,242.59 arc45 46.6,241.69 47.62,240.66 | 47.62,240.66 47.89,240.4 | 48.79,240.03 48.26,240.03 47.89,240.4 | 76.94,240.03 arc-45 77.84,239.66 | 79.25,240.79 78.76,240.79 arc45 77.86,240.42 77.47,240.03 76.94,240.03 | 76.94,240.03 63.5,240.03 | 63.5,240.03 48.79,240.03 | 48.79,240.03 arc-45 47.89,240.4 | 45.72,238.76 47.62,240.66 | 45.72,238.76 228.6,238.76 228.6,241.3 | 228.6,242.57 226.69,242.57 arc90 226.06,241.94 226.06,241.3 227.97,241.3 arc-90 228.6,240.66 H6.1 | 228.6,236.22 219.97,236.22 arc45 219.52,236.03 217.17,233.68
  Bottom 3.81: 217.17,233.68 101.6,233.68 | 101.6,233.68 101.6,234.69 | 101.6,234.69 arc-45 101.79,235.14 102.87,236.22 | 102.87,236.22 219.45,236.22 arc45 219.9,236.41 224.79,241.3 48.26,241.3 | C17.2 103.4,228.6 | 101.6,233.68 42.92,233.68 | 41.91,233.68 42.92,233.68 | 42.92,233.68 arc45 43.37,233.87 45.72,236.22 102.87,236.22 | 217.17,233.68 232.41,233.68 232.41,247.65 228.6,247.65 228.6,246.64 arc45 228.79,246.19 231.14,243.84 | C20.- C19.- 153.93,161.29 arc-45 153.48,161.48 152.4,162.56 152.4,161.29 C18.- C4.- C3.- C2.- 39.37,151.13 242.57,151.13 245.11,151.13 245.11,207.01 234.95,207.01 234.95,166.63 arc-45 234.76,166.18 226.06,157.48 41.91,157.48 41.91,155.2 arc45 42.1,154.75 43.18,153.67 225.8,153.67 arc45 226.25,153.86 234.95,162.56 242.57,162.56 242.57,153.67 229.87,153.67 236.22,160.02 241.3,160.02 241.3,159.01 arc-45 241.11,158.56 240.03,157.48 234.95,157.48 234.95,162.3 arc-45 235.14,162.75 238.76,166.37 H1.1 | 140.97,231.14 138.43,231.14 59.69,231.14 | 238.76,204.47 242.57,204.47 242.57,166.63 arc-45 242.38,166.18 240.03,163.83
  Bottom 6.452: 238.76,204.47 H1.1 | 228.6,236.22 H6.1 | 144.78,240.03 144.78,239.02 arc-45 144.59,238.57 138.43,232.41 | 38.1,161.29 21.59,161.29 21.59,143.51 243.84,143.51 243.84,150.87 arc45 243.65,148.78 242.57,151.13 242.57,150.12 arc-45 242.38,149.67 238.76,146.05 42.17,146.05 arc-45 41.72,146.24 35.56,152.4 35.56,156.21 26.67,156.21 | 26.67,156.21 26.67,150.12 arc45 26.86,149.67 | 26.86,149.67 27.94,148.59 28.95,148.59 arc45 29.4,148.78 31.75,151.13 34.29,148.59 | H2.1 27.94,149.86 arc-45 27.49,149.67 26.86,149.67 | H9.1 25.14,157.48 arc-45 25.59,157.29 26.67,156.21
PVCC  (3 unrouted)
  Bottom 3.81: D13.1 44.45,195.58 62.23,195.58 | 62.23,195.58 77.47,195.58 | 77.47,195.58 93.98,195.58 | 93.98,195.58 110.49,195.58 | 110.49,195.58 115.57,195.58 | 115.57,195.58 127,195.58 | 127,195.58 143.51,195.58 | 143.51,195.58 160.02,195.58 | 160.02,195.58 176.53,195.58 | 176.53,195.58 193.04,195.58 | 193.04,195.58 209.55,195.58 | 209.55,195.58 226.06,195.58 D11.1 | D9.1 209.55,195.58 | D8.1 193.04,195.58 | D7.1 176.53,195.58 | D6.1 160.02,195.58 | D4.1 127,195.58 | D10.1 143.51,195.58 | D3.1 110.49,195.58 | D2.1 93.98,195.58 | D1.1 77.47,195.58 | D14.1 60.96,196.85 62.23,195.58 | C18.+ C19.+ C20.+ 225.8,171.45 arc45 226.25,171.64 227.33,172.72 227.33,195.84 | 149.86,171.45 C18.+ | C18.+ 115.57,171.45 | 115.57,171.45 C4.+ C3.+ C2.+ | 115.57,171.45 115.57,192.78 arc45 115.38,193.23 114.3,194.31 114.3,195.32 arc45 114.11,195.77 113.03,196.85 113.03,198.12 115.31,198.12 arc-45 115.76,197.93 116.84,196.85 115.57,195.58 | 227.33,205.74 227.33,195.84 | 227.33,195.84 arc-45 227.14,195.39 224.79,193.04 118.11,193.04 118.11,173.99 224.79,173.99 224.79,191.77 123.45,191.77 arc45 123,191.58 120.65,189.23 120.65,177.8 223.52,177.8 223.52,186.43 arc45 223.33,186.88 222.25,187.96 124.46,187.96 124.46,180.34 220.98,180.34 220.98,184.15 127,184.15 | 110.49,172.72 40.64,172.72 39.37,172.72 39.37,205.74 89.91,205.74 arc-45 90.36,205.55 95.25,200.66 44.71,200.66 arc-45 44.26,200.85 41.91,203.2 41.91,176.79 arc45 42.1,176.34 43.18,175.26 114.3,175.26 114.3,188.97 arc45 114.11,189.42 111.76,191.77 47.25,191.77 arc-45 46.8,191.96 45.72,193.04 45.72,176.53 110.23,176.53 arc45 110.68,176.72 113.03,179.07 113.03,186.43 arc45 112.84,186.88 111.76,187.96 49.79,187.96 arc-45 49.34,188.15 48.26,189.23 48.26,179.07 109.22,179.07 109.22,183.89 arc-45 109.41,184.34 110.49,185.42 50.8,185.42 50.8,183.14 arc45 50.99,182.69 52.07,181.61 105.15,181.61 arc45 105.6,181.8 106.68,182.88
  Bottom 3.81: 224.79,205.74 46.99,205.74 46.99,198.12 224.79,198.12 224.79,201.93 48.26,201.93
  Bottom 6.452: 22.86,199.39 22.86,172.72 40.64,172.72 34.29,179.07 34.29,196.85 27.94,196.85 | 27.94,196.85 27.94,181.35 | 30.48,176.53 28.13,178.88 arc-45 27.94,179.33 27.94,181.35 | H3.1 27.94,196.85 | 27.94,181.35 arc45 27.75,181.8 H4.1
ROTOR
  Bottom 3.81: Q10.D 73.66,254 | 73.66,254 73.66,256.54 | 73.66,257.55 73.66,259.08 73.66,264.16 90.17,264.16 | 90.17,264.16 106.68,264.16 | 106.68,264.16 123.19,264.16 | 123.19,264.16 139.7,264.16 | 139.7,264.16 156.21,264.16 | 156.21,264.16 172.72,264.16 | 172.72,264.16 189.23,264.16 | 189.23,264.16 205.74,264.16 | 205.74,264.16 222.25,264.16 222.25,256.54 | 222.25,256.54 Q1.D | Q2.D 205.74,264.16 | Q3.D 189.23,264.16 | Q4.D 172.72,264.16 | Q5.D 156.21,264.16 | Q6.D 139.7,264.16 | Q7.D 123.19,264.16 | Q8.D 106.68,264.16 | Q9.D 90.17,264.16 | D11.2 R24.2 | 231.14,219.71 222.25,223.52 218.81,223.89 arc-45 217.91,223.52 R24.2 | 223.52,255.27 237.49,255.27 240.03,252.73 | 223.52,255.27 222.25,256.54 | 182.88,223.52 166.37,223.52 | 166.37,223.52 R17.2 149.86,223.52 | 149.86,223.52 133.35,223.52 | 133.35,223.52 116.84,223.52 | 116.84,223.52 100.33,223.52 | 100.33,223.52 83.82,223.52 | 83.82,223.52 68.58,223.52 67.31,222.25 67.31,220.98 | 67.31,218.44 D1.2 | D8.2 182.88,223.52 | D7.2 166.37,220.98 | 166.37,220.98 166.37,222.25 | D6.2 149.86,223.52 | D10.2 133.35,223.52 | D4.2 116.84,223.52 | D3.2 100.33,223.52 | D2.2 83.82,223.52 | 182.88,223.52 199.39,223.52 | 199.39,223.52 R24.2 | D9.2 199.39,223.52 | D5.1 101.6,221.72 arc45 101.23,222.62 100.33,223.52 | 67.31,218.44 242.57,218.44 243.65,219.52 arc45 243.84,219.97 243.84,262.89 242.76,263.97 arc45 242.31,264.16 223.52,264.16 223.52,257.81 235.96,257.81 arc-45 236.41,257.62 237.49,256.54 237.49,260.35 227.33,260.35 227.33,261.62 | 67.31,218.44 67.31,220.98 | 67.31,220.98 D12.1 165.1,220.98 | 165.1,220.98 166.37,220.98 | 166.37,220.98 214.63,220.98 | 165.1,220.98 166.37,222.25 | 166.37,222.25 166.37,223.52
  Bottom 3.81: 223.52,255.27 75.19,255.27 arc-45 74.74,255.46 73.66,256.54 | 73.66,256.54 73.66,257.55 | 73.66,257.55 arc-45 73.85,258 74.93,259.08 220.98,259.08 218.44,261.62 76.2,261.62 | R24.2 240.03,223.52 240.03,250.19 | 240.03,250.19 240.03,252.73 | 240.03,252.73 240.03,260.09 arc-45 240.22,260.54 241.3,261.62 241.3,251.2 | 241.3,231.14 241.3,222.51 arc-45 241.11,222.06 240.03,220.98 240.03,224.53 arc45 239.84,224.98 237.49,227.33 237.23,227.33 | 237.23,227.33 222.51,227.33 arc45 222.06,227.14 219.71,224.79 | 237.23,227.33 arc45 237.68,227.52 241.3,231.14 | 241.3,231.14 241.3,251.2 | 241.3,251.2 arc45 241.11,251.65 240.03,252.73 | 240.03,250.19 236.22,254 73.66,254
  Bottom 6.452: 73.66,259.08 63.69,269.05 arc45 63.24,269.24 H5.1 | 240.03,252.73 240.03,230.13 arc-45 239.84,229.68 236.22,226.06
RPM
  Bottom 1.016: U$1.D3 R8.1
SCK.SPI  (1 unrouted)
SCL  (1 unrouted)
SDA  (1 unrouted)
SEC.FET  (2 unrouted)
  Top 1.676: R27.1 R28.1
SEC.PWM  (1 unrouted)
SI.SPI  (1 unrouted)
SO.SPI  (1 unrouted)
STATOR
  Bottom 3.81: Q11.D 57.15,254 | 57.15,254 57.15,254.74 | 57.15,254.74 arc45 56.78,255.64 54.61,257.81 43.71,257.81 arc45 42.81,257.44 40.64,255.27 Q12.D 40.64,245.37 arc-45 40.45,244.92 34.29,238.76 34.29,219.71 | D15.1 40.45,223.33 arc-45 40.9,223.52 R29.2 49.34,221.17 arc-45 49.53,220.72 49.53,219.71 | D14.2 50.8,218.18 arc45 50.61,218.63 49.53,219.71 | 49.53,219.71 34.29,219.71 | 34.29,219.71 D13.2 | 40.64,257.81 31.75,257.81 29.21,257.81 | 29.21,257.81 29.21,254 | 29.21,252.99 29.21,252.47 | 29.21,245.11 29.21,213.36 D13.2 | D13.2 34.29,214.37 arc45 34.1,214.82 33.02,215.9 33.02,241.04 arc45 32.83,241.49 29.21,245.11 | 29.21,245.11 29.21,252.47 | 29.21,252.47 arc-45 29.4,252.92 33.02,256.54 36.57,256.54 arc-45 37.02,256.35 39.37,254 | 39.37,254 29.21,254 | 39.37,254 57.15,254 | 57.15,254.74 57.15,257.81 | 57.15,259.08 30.74,259.08 arc45 30.29,258.89 29.21,257.81 | 29.21,254 29.21,252.99 | 29.21,252.99 arc45 29.4,252.54 30.48,251.46 | 31.75,252.73 30.48,251.46 | 30.48,251.46 30.48,242.57 31.49,242.57 arc-45 31.94,242.38 34.29,240.03
  Bottom 6.452: 31.75,257.81 22.86,257.81 22.86,243.84 | 22.86,243.84 22.86,213.36 | 22.86,213.36 25.14,213.36 arc45 25.59,213.55 27.94,215.9 27.94,253.74 arc45 27.75,254.19 26.67,255.27 | 33.02,210.82 25.66,210.82 arc-45 25.21,211.01 22.86,213.36 | H7.1 25.4,245.37 | 25.4,248.92 25.4,245.37 | 25.4,245.37 arc45 25.59,244.92 26.67,243.84 | 26.67,243.84 26.67,242.83 arc-45 26.48,242.38 25.4,241.3 | 25.4,241.3 25.4,242.31 arc-45 25.59,242.76 | 25.59,242.76 26.67,243.84 | 26.67,243.84 H7.1 | 24.13,243.84 H7.1 | 22.86,243.84 24.24,243.84 arc-45 24.69,243.65 25.59,242.76 | 25.4,241.3 H8.1
V.HV  (2 unrouted)

### Text on the board
Dimension: ROTOR | STATOR | CURRENT SENZ | PVCC | PGND